# Altium schematic sheet zxuno.SchDoc
size 386 x 246 mm
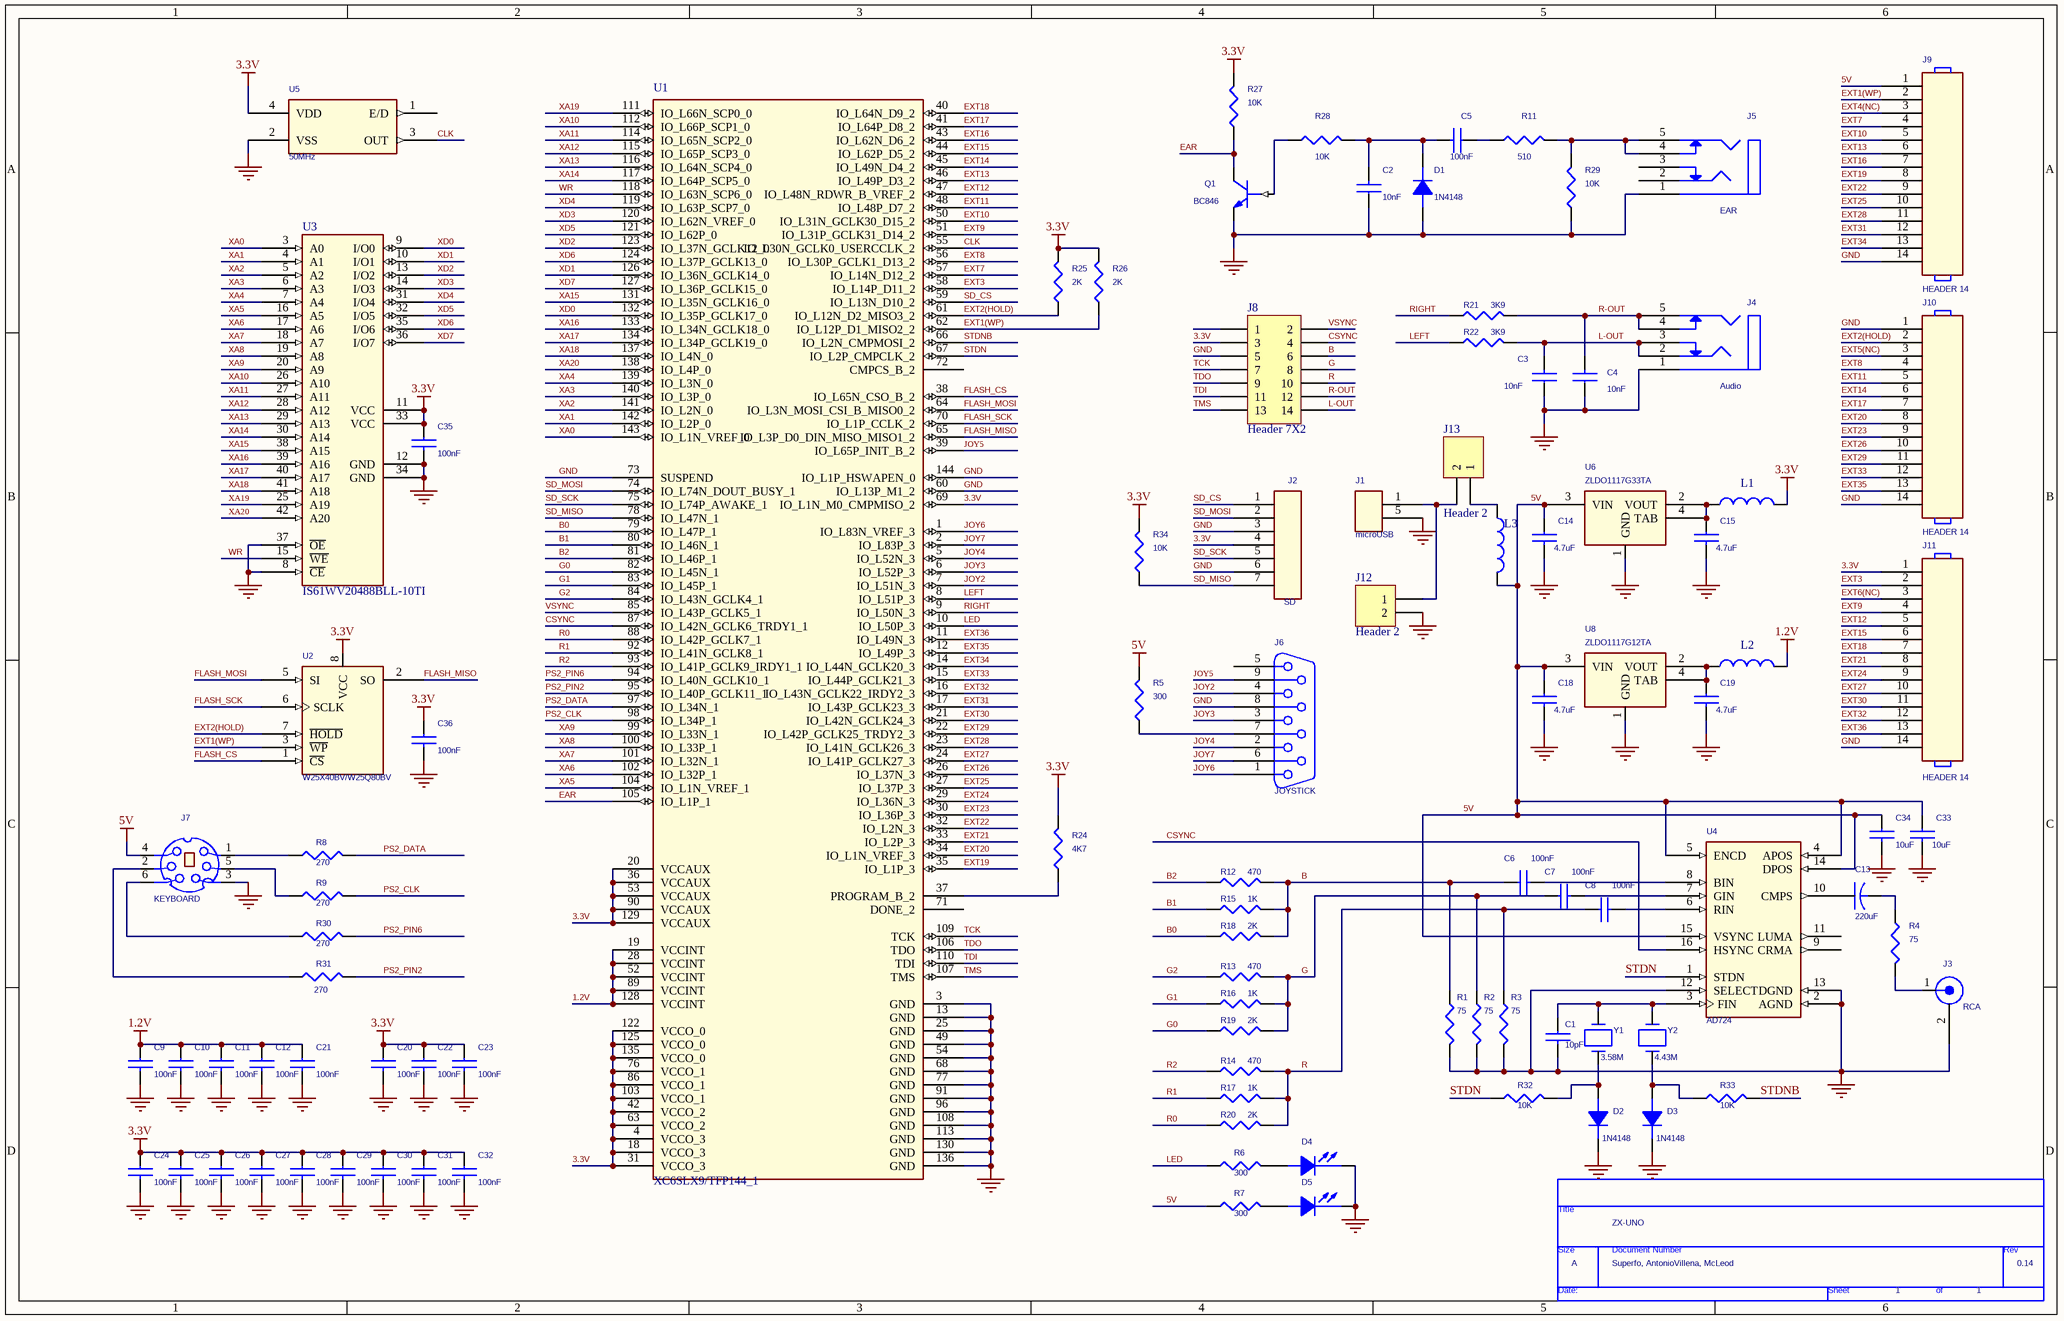
[diagram p0: zxuno.SchDoc]

## Parts
*  Page Count: 1  Page Size: A  Title: ZX-UNO  RevCode: 0.14  Doc: Superfo, AntonioVillena, McLeod  (hidden comment: TitleBlock0)  (graphical)
C1  10pF  [SM/C_0805]
C2  10nF  [SM/C_0805]
C3  10nF  [SM/C_0805]
C4  10nF  [SM/C_0805]
C5  100nF  [SM/C_0603]
C6  100nF  [SM/C_0603]
C7  100nF  [SM/C_0603]
C8  100nF  [SM/C_0603]
C9  100nF  [SM/C_0603]
C10  100nF  [SM/C_0603]
C11  100nF  [SM/C_0603]
C12  100nF  [SM/C_0603]
C13  220uF  [CAP/D6.6MM]
C14  4.7uF  [SM/C_0805]
C15  4.7uF  [SM/C_0805]
C18  4.7uF  [SM/C_0805]
C19  4.7uF  [SM/C_0805]
C20  100nF  [SM/C_0603]
C21  100nF  [SM/C_0603]
C22  100nF  [SM/C_0603]
C23  100nF  [SM/C_0603]
C24  100nF  [SM/C_0603]
C25  100nF  [SM/C_0603]
C26  100nF  [SM/C_0603]
C27  100nF  [SM/C_0603]
C28  100nF  [SM/C_0603]
C29  100nF  [SM/C_0603]
C30  100nF  [SM/C_0603]
C31  100nF  [SM/C_0603]
C32  100nF  [SM/C_0603]
C33  10uF  [SM/C_0805]
C34  10uF  [SM/C_0805]
C35  100nF  [SM/C_0603]
C36  100nF  [SM/C_0603]
D1  1N4148  [SM/DO213AA_21]
D2  1N4148  [SM/DO213AA_21]
D3  1N4148  [SM/DO213AA_21]
D4  LED  [SM/D_0805_21]  (value not drawn)
D5  LED  [SM/D_0805_21]  (value not drawn)
J1  microUSB  [MICRO USB 609-4613-1-ND]
J2  SD  [SD 101-00708-64-ND]
J3  RCA  [RCA JACK RCJ-04X - duplicate]
J4  Audio  [AUDIO JACK PSG01538 - duplicate]
J5  EAR  [AUDIO JACK PSG01538 - duplicate]
J6  JOYSTICK  [DSUB/RP.318/TM/9 - duplicate]
J7  KEYBOARD  [DINC/MIN_TM/6]
J8  Header 7X2  [HDR2X7]
J9  HEADER 14  [BLKCON.100/VH/TM1SQ/W.100/14]
J10  HEADER 14  [BLKCON.100/VH/TM1SQ/W.100/14]
J11  HEADER 14  [BLKCON.100/VH/TM1SQ/W.100/14]
J12  Header 2  [HDR1X2]
J13  Header 2  [HDR1X2]
L1  Inductor  [SM/L_0805]  (value not drawn)
L2  Inductor  [SM/L_0805]  (value not drawn)
L3  Inductor  [SM/L_0805]  (value not drawn)
Q1  BC846  [SM/SOT23_231]
R1  75  [SM/R_0805]
R2  75  [SM/R_0805]
R3  75  [SM/R_0805]
R4  75  [SM/R_0805]
R5  300  [SM/R_0805]
R6  300  [SM/R_0805]
R7  300  [SM/R_0805]
R8  270  [SM/R_0805]
R9  270  [SM/R_0805]
R11  510  [SM/R_0805]
R12  470  [SM/R_0805]
R13  470  [SM/R_0805]
R14  470  [SM/R_0805]
R15  1K  [SM/R_0805]
R16  1K  [SM/R_0805]
R17  1K  [SM/R_0805]
R18  2K  [SM/R_0805]
R19  2K  [SM/R_0805]
R20  2K  [SM/R_0805]
R21  3K9  [SM/R_0805]
R22  3K9  [SM/R_0805]
R24  4K7  [SM/R_0805]
R25  2K  [SM/R_0805]
R26  2K  [SM/R_0805]
R27  10K  [SM/R_0805]
R28  10K  [SM/R_0805]
R29  10K  [SM/R_0805]
R30  270  [SM/R_0805]
R31  270  [SM/R_0805]
R32  10K  [SM/R_0805]
R33  10K  [SM/R_0805]
R34  10K  [SM/R_0805]
U1  XC6SLX9/TFP144_1
U2  W25X40BV/W25Q80BV  [SOJ.050/8/WB.300/L.200]
U3  IS61WV20488BLL-10TI  [SOP80P1176-44M]
U4  AD724  [SOJ.050/16/WB.400/L.400]
U5  50MHz  [SM/OSC]
U6  ZLDO1117G33TA  [SM/SOT223]
U8  ZLDO1117G12TA  [SM/SOT223]
Y1  3.58M  [RAD/.300X.125/LS.200/.031]
Y2  4.43M  [RAD/.300X.125/LS.200/.031]

## Nets
1.2V: C9.1 C10.1 C11.1 C12.1 C21.1 L2.2 U1.19(VCCINT) U1.28(VCCINT) U1.52(VCCINT) U1.89(VCCINT) U1.128(VCCINT)
3.3V: C20.1 C22.1 C23.1 C24.1 C25.1 C26.1 C27.1 C28.1 C29.1 C30.1 C31.1 C32.1 C35.1 C36.1 J2.4 J8.3 J11.1 L1.2 R24.2 R25.2 R26.2 R27.1 R34.2 U1.4(VCCO_3) U1.18(VCCO_3) U1.20(VCCAUX) U1.31(VCCO_3) U1.36(VCCAUX) U1.42(VCCO_2) U1.53(VCCAUX) U1.63(VCCO_2) U1.69(IO_L1N_M0_CMPMISO_2) U1.76(VCCO_1) U1.86(VCCO_1) U1.90(VCCAUX) U1.103(VCCO_1) U1.122(VCCO_0) U1.125(VCCO_0) U1.129(VCCAUX) U1.135(VCCO_0) U2.8(VCC) U3.11(VCC) U3.33(VCC) U5.4(VDD)
5V: C14.1 C18.1 C33.1 C34.1 J7.4 J9.1 L3.2 R5.2 R7.1 U4.4(APOS) U4.5(ENCD) U4.14(DPOS) U4.15(VSYNC) U6.3(VIN) U8.3(VIN)
GND: C1.2 C2.1 C3.1 C4.1 C9.2 C10.2 C11.2 C12.2 C14.2 C15.2 C18.2 C19.2 C20.2 C21.2 C22.2 C23.2 C24.2 C25.2 C26.2 C27.2 C28.2 C29.2 C30.2 C31.2 C32.2 C33.2 C34.2 C35.2 C36.2 D1.1(A) D2.2(K) D3.2(K) D4.2(CATHODE) D5.2(CATHODE) J1.5 J2.3 J2.6 J3.2(SHIELD) J4.1(E) J5.1(E) J6.8 J7.3 J7.M1(GND) J7.M2(GND) J7.M3(GND) J8.5 J9.14 J10.1 J10.14 J11.14 J12.2 Q1.3(EMITTER) R1.2 R2.2 R3.2 R29.2 U1.3(GND) U1.13(GND) U1.25(GND) U1.49(GND) U1.54(GND) U1.60(IO_L13P_M1_2) U1.68(GND) U1.73(SUSPEND) U1.77(GND) U1.91(GND) U1.96(GND) U1.108(GND) U1.113(GND) U1.130(GND) U1.136(GND) U1.144(IO_L1P_HSWAPEN_0) U2.4(GND) U3.8(~{CE}) U3.12(GND) U3.34(GND) U3.37(~{OE}) U4.2(AGND) U4.12(SELECT) U4.13(DGND) U5.2(VSS) U6.1(GND) U8.1(GND)
B: C6.1 J8.6 R1.1 R12.2 R15.2 R18.2
B0: R18.1 U1.79(IO_L47P_1)
B1: R15.1 U1.80(IO_L46N_1)
B2: R12.1 U1.81(IO_L46P_1)
CLK: U1.55(IO_L30N_GCLK0_USERCCLK_2) U5.3(OUT)
CSYNC: J8.4 U1.87(IO_L42N_GCLK6_TRDY1_1) U4.16(HSYNC)
EAR: Q1.1(COLLECTOR) R27.2 U1.105(IO_L1P_1)
EXT1(WP): J9.2 R26.1 U1.62(IO_L12P_D1_MISO2_2) U2.3(~{WP})
EXT2(HOLD): J10.2 R25.1 U1.61(IO_L12N_D2_MISO3_2) U2.7(~{HOLD})
EXT3: J11.2 U1.58(IO_L14P_D11_2)
EXT4(NC): J9.3
EXT5(NC): J10.3
EXT6(NC): J11.3
EXT7: J9.4 U1.57(IO_L14N_D12_2)
EXT8: J10.4 U1.56(IO_L30P_GCLK1_D13_2)
EXT9: J11.4 U1.51(IO_L31P_GCLK31_D14_2)
EXT10: J9.5 U1.50(IO_L31N_GCLK30_D15_2)
EXT11: J10.5 U1.48(IO_L48P_D7_2)
EXT12: J11.5 U1.47(IO_L48N_RDWR_B_VREF_2)
EXT13: J9.6 U1.46(IO_L49P_D3_2)
EXT14: J10.6 U1.45(IO_L49N_D4_2)
EXT15: J11.6 U1.44(IO_L62P_D5_2)
EXT16: J9.7 U1.43(IO_L62N_D6_2)
EXT17: J10.7 U1.41(IO_L64P_D8_2)
EXT18: J11.7 U1.40(IO_L64N_D9_2)
EXT19: J9.8 U1.35(IO_L1P_3)
EXT20: J10.8 U1.34(IO_L1N_VREF_3)
EXT21: J11.8 U1.33(IO_L2P_3)
EXT22: J9.9 U1.32(IO_L2N_3)
EXT23: J10.9 U1.30(IO_L36P_3)
EXT24: J11.9 U1.29(IO_L36N_3)
EXT25: J9.10 U1.27(IO_L37P_3)
EXT26: J10.10 U1.26(IO_L37N_3)
EXT27: J11.10 U1.24(IO_L41P_GCLK27_3)
EXT28: J9.11 U1.23(IO_L41N_GCLK26_3)
EXT29: J10.11 U1.22(IO_L42P_GCLK25_TRDY2_3)
EXT30: J11.11 U1.21(IO_L42N_GCLK24_3)
EXT31: J9.12 U1.17(IO_L43P_GCLK23_3)
EXT32: J11.12 U1.16(IO_L43N_GCLK22_IRDY2_3)
EXT33: J10.12 U1.15(IO_L44P_GCLK21_3)
EXT34: J9.13 U1.14(IO_L44N_GCLK20_3)
EXT35: J10.13 U1.12(IO_L49P_3)
EXT36: J11.13 U1.11(IO_L49N_3)
FLASH_CS: U1.38(IO_L65N_CSO_B_2) U2.1(~{CS})
FLASH_MISO: U1.65(IO_L3P_D0_DIN_MISO_MISO1_2) U2.2(SO)
FLASH_MOSI: U1.64(IO_L3N_MOSI_CSI_B_MISO0_2) U2.5(SI)
FLASH_SCK: U1.70(IO_L1P_CCLK_2) U2.6(SCLK)
G: C7.1 J8.8 R2.1 R13.2 R16.2 R19.2
G0: R19.1 U1.82(IO_L45N_1)
G1: R16.1 U1.83(IO_L45P_1)
G2: R13.1 U1.84(IO_L43N_GCLK4_1)
JOY2: J6.4 U1.7(IO_L51N_3)
JOY3: J6.3 U1.6(IO_L52P_3)
JOY4: J6.2 U1.5(IO_L52N_3)
JOY5: J6.9 U1.39(IO_L65P_INIT_B_2)
JOY6: J6.1 U1.1(IO_L83N_VREF_3)
JOY7: J6.6 U1.2(IO_L83P_3)
L-OUT: C3.2 J4.2(D) J4.3(C) J8.14 R22.2
LED: R6.1 U1.10(IO_L50P_3)
LEFT: R22.1 U1.8(IO_L51P_3)
PS2_CLK: R9.2 U1.98(IO_L34P_1)
PS2_DATA: R8.2 U1.97(IO_L34N_1)
PS2_PIN2: R31.2 U1.95(IO_L40P_GCLK11_1)
PS2_PIN6: R30.2 U1.94(IO_L40N_GCLK10_1)
R: C8.1 J8.10 R3.1 R14.2 R17.2 R20.2
R0: R20.1 U1.88(IO_L42P_GCLK7_1)
R1: R17.1 U1.92(IO_L41N_GCLK8_1)
R2: R14.1 U1.93(IO_L41P_GCLK9_IRDY1_1)
R-OUT: C4.2 J4.4(B) J4.5(A) J8.12 R21.2
RIGHT: R21.1 U1.9(IO_L50N_3)
SD_CS: J2.1 U1.59(IO_L13N_D10_2)
SD_MISO: J2.7 R34.1 U1.78(IO_L47N_1)
SD_MOSI: J2.2 U1.74(IO_L74N_DOUT_BUSY_1)
SD_SCK: J2.5 U1.75(IO_L74P_AWAKE_1)
STDN: R32.1 U1.67(IO_L2P_CMPCLK_2) U4.1(STDN)
STDNB: R33.2 U1.66(IO_L2N_CMPMOSI_2)
TCK: J8.7 U1.109(TCK)
TDI: J8.11 U1.110(TDI)
TDO: J8.9 U1.106(TDO)
TMS: J8.13 U1.107(TMS)
VSYNC: J8.2 U1.85(IO_L43P_GCLK5_1)
WR: U1.118(IO_L63N_SCP6_0) U3.15(~{WE})
XA0: U1.143(IO_L1N_VREF_0) U3.3(A0)
XA1: U1.142(IO_L2P_0) U3.4(A1)
XA2: U1.141(IO_L2N_0) U3.5(A2)
XA3: U1.140(IO_L3P_0) U3.6(A3)
XA4: U1.139(IO_L3N_0) U3.7(A4)
XA5: U1.104(IO_L1N_VREF_1) U3.16(A5)
XA6: U1.102(IO_L32P_1) U3.17(A6)
XA7: U1.101(IO_L32N_1) U3.18(A7)
XA8: U1.100(IO_L33P_1) U3.19(A8)
XA9: U1.99(IO_L33N_1) U3.20(A9)
XA10: U1.112(IO_L66P_SCP1_0) U3.26(A10)
XA11: U1.114(IO_L65N_SCP2_0) U3.27(A11)
XA12: U1.115(IO_L65P_SCP3_0) U3.28(A12)
XA13: U1.116(IO_L64N_SCP4_0) U3.29(A13)
XA14: U1.117(IO_L64P_SCP5_0) U3.30(A14)
XA15: U1.131(IO_L35N_GCLK16_0) U3.38(A15)
XA16: U1.133(IO_L34N_GCLK18_0) U3.39(A16)
XA17: U1.134(IO_L34P_GCLK19_0) U3.40(A17)
XA18: U1.137(IO_L4N_0) U3.41(A18)
XA19: U1.111(IO_L66N_SCP0_0) U3.25(A19)
XA20: U1.138(IO_L4P_0) U3.42(A20)
XD0: U1.132(IO_L35P_GCLK17_0) U3.9(I/O0)
XD1: U1.126(IO_L36N_GCLK14_0) U3.10(I/O1)
XD2: U1.123(IO_L37N_GCLK12_0) U3.13(I/O2)
XD3: U1.120(IO_L62N_VREF_0) U3.14(I/O3)
XD4: U1.119(IO_L63P_SCP7_0) U3.31(I/O4)
XD5: U1.121(IO_L62P_0) U3.32(I/O5)
XD6: U1.124(IO_L37P_GCLK13_0) U3.35(I/O6)
XD7: U1.127(IO_L36P_GCLK15_0) U3.36(I/O7)
NetC1_1: C1.1 U4.3(FIN) Y1.1 Y2.1
NetC2_2: C2.2 C5.2 D1.2(K) R28.1
NetC5_1: C5.1 R11.2
NetC6_2: C6.2 U4.8(BIN)
NetC7_2: C7.2 U4.7(GIN)
NetC8_2: C8.2 U4.6(RIN)
NetC13_1: C13.1 U4.10(CMPS)
NetC13_2: C13.2 R4.1
NetC15_1: C15.1 L1.1 U6.2(VOUT) U6.4(TAB)
NetC19_1: C19.1 L2.1 U8.2(VOUT) U8.4(TAB)
NetD2_1: D2.1(A) R32.2 Y1.2
NetD3_1: D3.1(A) R33.1 Y2.2
NetD4_1: D4.1(ANODE) R6.2
NetD5_1: D5.1(ANODE) R7.2
NetJ1_1: J1.1 J12.1 J13.2
NetJ3_1: J3.1(CENTER) R4.2
NetJ5_4: J5.4(B) J5.5(A) R11.1 R29.1
NetJ6_7: J6.7 R5.1
NetJ7_1: J7.1 R8.1
NetJ7_2: J7.2 R31.1
NetJ7_5: J7.5 R9.1
NetJ7_6: J7.6 R30.1
NetJ13_1: J13.1 L3.1
NetQ1_2: Q1.2(BASE) R28.2
NetR24_1: R24.1 U1.37(PROGRAM_B_2)

Not connected (* = marked no-connect by the designer): J5 2(D) 3(C); J6 5; J8 1; U1 71(DONE_2) 72(CMPCS_B_2); U4 9(CRMA) 11(LUMA); U5 1(E/D)

## Notes on the sheet
- (in symbol TitleBlock0) Title; Size; Document Number; Rev; Date:; Sheet; of

## Library data of the parts
C1 = CAP NP_Dup1: COMPHEIGHT: 0.000; MEMORY: NO; COMPGROUP: 0; COMPROT: 180; COMPLOC: [670.000,100.000]; COMPSIDE: TOP; FPLIST: SM/C_0805_VIA2,SM/C_0805,RAD/.200X.100/LS.100/.031; DECOUPLER: NO; COMPKEY: NO; COMPLOCKED: NO; COMPFIXED: NO
C2 = CAP NP_Dup1: COMPHEIGHT: 0.000; MEMORY: NO; COMPGROUP: 0; COMPLOC: [2509.000,545.000]; COMPSIDE: BOT; DECOUPLER: NO; COMPKEY: NO; COMPLOCKED: NO; COMPFIXED: NO; COMPROT: 0
C3 = CAP NP_Dup1: COMPHEIGHT: 0.000; MEMORY: NO; COMPGROUP: 0; COMPROT: 270; COMPLOC: [2755.000,1705.000]; COMPSIDE: BOT; FPLIST: SM/C_0805_VIA,SM/C_0805_VIA1,SM/C_0805; DECOUPLER: NO; COMPKEY: NO; COMPLOCKED: NO; COMPFIXED: NO
C4 = CAP NP_Dup1: COMPHEIGHT: 0.000; MEMORY: NO; COMPGROUP: 0; COMPROT: 270; COMPLOC: [2560.000,1705.000]; COMPSIDE: BOT; FPLIST: SM/C_0805_VIA1,SM/C_0805; DECOUPLER: NO; COMPKEY: NO; COMPLOCKED: NO; COMPFIXED: NO
C5 = CAP NP_Dup1: COMPHEIGHT: 0.000; MEMORY: NO; COMPGROUP: 0; COMPLOC: [2510.000,465.000]; COMPSIDE: BOT; DECOUPLER: NO; COMPKEY: NO; COMPLOCKED: NO; COMPFIXED: NO; COMPROT: 0
C6 = CAP NP_Dup1: FPLIST: SM/C_0805; COMPSIDE: TOP; COMPLOC: [1180.000,560.000]; COMPROT: 180; COMPGROUP: 0; COMPFIXED: NO; COMPHEIGHT: 0.000; COMPLOCKED: NO; COMPKEY: NO; DECOUPLER: NO; MEMORY: NO
C7 = CAP NP_Dup1: COMPHEIGHT: 0.000; MEMORY: NO; COMPGROUP: 0; COMPROT: 90; COMPLOC: [1175.000,420.000]; COMPSIDE: TOP; FPLIST: SM/C_0805; DECOUPLER: NO; COMPKEY: NO; COMPLOCKED: NO; COMPFIXED: NO
C8 = CAP NP_Dup1: FPLIST: SM/C_0603,SM/C_0805; COMPSIDE: TOP; COMPLOC: [1100.000,405.000]; COMPROT: 90; COMPGROUP: 0; COMPFIXED: NO; COMPHEIGHT: 0.000; COMPLOCKED: NO; COMPKEY: NO; DECOUPLER: NO; MEMORY: NO
C9 = CAP NP: FPLIST: SM/C_0603_VIA,SM/C_0805,SM/C_0603,SM/C_0603_VIA1; COMPSIDE: BOT; COMPLOC: [1820.000,1500.000]; COMPROT: 180; COMPGROUP: 0; COMPFIXED: NO; COMPHEIGHT: 0.000; COMPLOCKED: NO; COMPKEY: NO; DECOUPLER: NO; MEMORY: NO
C10 = CAP NP: FPLIST: SM/C_0805,SM/C_0603; COMPSIDE: BOT; COMPLOC: [1255.000,1345.000]; COMPROT: 90; COMPGROUP: 0; COMPFIXED: NO; COMPHEIGHT: 0.000; COMPLOCKED: NO; COMPKEY: NO; DECOUPLER: NO; MEMORY: NO
C11 = CAP NP: FPLIST: SM/C_0603,SM/C_0805,SM/C_0603_VIA; COMPSIDE: BOT; COMPLOC: [1440.000,795.000]; COMPROT: 180; COMPGROUP: 0; COMPFIXED: NO; COMPHEIGHT: 0.000; COMPLOCKED: NO; COMPKEY: NO; DECOUPLER: NO; MEMORY: NO
C12 = CAP NP: FPLIST: SM/C_0805,SM/C_0603,SM/C_0603_VIA,SM/C_0603_VIA1,SM/C_0603_VIA2; COMPSIDE: BOT; COMPLOC: [1965.000,916.000]; COMPROT: 90; COMPGROUP: 0; COMPFIXED: NO; COMPHEIGHT: 0.000; COMPLOCKED: NO; COMPKEY: NO; DECOUPLER: NO; MEMORY: NO
C13 = CAP: COMPSIDE: TOP; COMPLOC: [2160.000,2000.000]; COMPROT: 270; COMPGROUP: 0; COMPFIXED: NO; COMPHEIGHT: 0.000; COMPLOCKED: NO; COMPKEY: NO; DECOUPLER: NO; MEMORY: NO
C14 = CAP NP: COMPHEIGHT: 0.000; MEMORY: NO; COMPGROUP: 0; COMPLOC: [340.000,620.000]; COMPSIDE: TOP; FPLIST: SM/C_0805_VIA,SM/C_0805_VIA1,SM/C_0603,SM/C_0805; DECOUPLER: NO; COMPKEY: NO; COMPLOCKED: NO; COMPFIXED: NO; COMPROT: 0
C15 = CAP NP: FPLIST: SM/C_0805,SM/C_0603_VIA,SM/C_0603,SM/C_0805_VIA; COMPSIDE: TOP; COMPLOC: [250.000,620.000]; COMPROT: 180; COMPGROUP: 0; COMPFIXED: NO; COMPHEIGHT: 0.000; COMPLOCKED: NO; COMPKEY: NO; DECOUPLER: NO; MEMORY: NO
C18 = CAP NP: COMPHEIGHT: 0.000; MEMORY: NO; COMPGROUP: 0; COMPLOC: [1485.000,1660.000]; COMPSIDE: BOT; FPLIST: SM/C_0805_VIA2,SM/C_0805_VIA,SM/C_0805_VIA1,SM/C_0603,SM/C_0805; DECOUPLER: NO; COMPKEY: NO; COMPLOCKED: NO; COMPFIXED: NO; COMPROT: 0
C19 = CAP NP: FPLIST: SM/C_0805_VIA2,SM/C_0805,SM/C_0603_VIA,SM/C_0603,SM/C_0805_VIA; COMPSIDE: BOT; COMPLOC: [1575.000,1660.000]; COMPROT: 180; COMPGROUP: 0; COMPFIXED: NO; COMPHEIGHT: 0.000; COMPLOCKED: NO; COMPKEY: NO; DECOUPLER: NO; MEMORY: NO
C20 = CAP NP: FPLIST: SM/C_0603_VIA,SM/C_0603,SM/C_0805,SM/C_0603_VIA1; COMPSIDE: BOT; COMPLOC: [1345.000,1500.000]; COMPROT: 0; COMPFIXED: NO; COMPHEIGHT: 0.000; COMPGROUP: 0; COMPLOCKED: NO; COMPKEY: NO; DECOUPLER: NO; MEMORY: NO
C21 = CAP NP: FPLIST: SM/C_0805,SM/C_0603,SM/C_0603_VIA; COMPSIDE: BOT; COMPLOC: [1255.000,910.000]; COMPROT: 90; COMPGROUP: 0; COMPFIXED: NO; COMPHEIGHT: 0.000; COMPLOCKED: NO; COMPKEY: NO; DECOUPLER: NO; MEMORY: NO
C22 = CAP NP: FPLIST: SM/C_0805,SM/C_0603,SM/C_0603_VIA; COMPSIDE: BOT; COMPLOC: [1874.000,795.000]; COMPROT: 180; COMPGROUP: 0; COMPFIXED: NO; COMPHEIGHT: 0.000; COMPLOCKED: NO; COMPKEY: NO; DECOUPLER: NO; MEMORY: NO
C23 = CAP NP: FPLIST: SM/C_0603,SM/C_0805; COMPSIDE: BOT; COMPLOC: [1965.000,1335.000]; COMPROT: 90; COMPGROUP: 0; COMPFIXED: NO; COMPHEIGHT: 0.000; COMPLOCKED: NO; COMPKEY: NO; DECOUPLER: NO; MEMORY: NO
C24 = CAP NP: FPLIST: SM/C_0603_VIA1,SM/C_0603,SM/C_0805,SM/C_0603_VIA; COMPSIDE: BOT; COMPLOC: [1695.000,1500.000]; COMPROT: 180; COMPGROUP: 0; COMPFIXED: NO; COMPHEIGHT: 0.000; COMPLOCKED: NO; COMPKEY: NO; DECOUPLER: NO; MEMORY: NO
C25 = CAP NP: FPLIST: SM/C_0805,SM/C_0603; COMPSIDE: BOT; COMPLOC: [1415.000,1500.000]; COMPROT: 180; COMPGROUP: 0; COMPFIXED: NO; COMPHEIGHT: 0.000; COMPLOCKED: NO; COMPKEY: NO; DECOUPLER: NO; MEMORY: NO
C26 = CAP NP: FPLIST: SM/C_0805,SM/C_0603; COMPSIDE: BOT; COMPLOC: [1375.000,795.000]; COMPROT: 0; COMPFIXED: NO; COMPHEIGHT: 0.000; COMPGROUP: 0; COMPLOCKED: NO; COMPKEY: NO; DECOUPLER: NO; MEMORY: NO
C27 = CAP NP: FPLIST: SM/C_0603,SM/C_0805; COMPSIDE: BOT; COMPLOC: [1255.000,985.000]; COMPROT: 270; COMPGROUP: 0; COMPFIXED: NO; COMPHEIGHT: 0.000; COMPLOCKED: NO; COMPKEY: NO; DECOUPLER: NO; MEMORY: NO
C28 = CAP NP: FPLIST: SM/C_0603,SM/C_0805,SM/C_0603_VIA; COMPSIDE: BOT; COMPLOC: [1695.000,1325.000]; COMPROT: 0; COMPFIXED: NO; COMPHEIGHT: 0.000; COMPGROUP: 0; COMPLOCKED: NO; COMPKEY: NO; DECOUPLER: NO; MEMORY: NO
C29 = CAP NP: FPLIST: SM/C_0603_VIA1,SM/C_0603_VIA,SM/C_0805,SM/C_0603; COMPSIDE: BOT; COMPLOC: [1255.000,1220.000]; COMPROT: 90; COMPGROUP: 0; COMPFIXED: NO; COMPHEIGHT: 0.000; COMPLOCKED: NO; COMPKEY: NO; DECOUPLER: NO; MEMORY: NO
C30 = CAP NP: FPLIST: SM/C_0805,SM/C_0603; COMPSIDE: BOT; COMPLOC: [1805.000,795.000]; COMPROT: 0; COMPFIXED: NO; COMPHEIGHT: 0.000; COMPGROUP: 0; COMPLOCKED: NO; COMPKEY: NO; DECOUPLER: NO; MEMORY: NO
C31 = CAP NP: FPLIST: SM/C_0603,SM/C_0805,SM/C_0603_VIA,SM/C_0603_VIA1,SM/C_0603_VIA2; COMPSIDE: BOT; COMPLOC: [1965.000,1040.000]; COMPROT: 90; COMPGROUP: 0; COMPFIXED: NO; COMPHEIGHT: 0.000; COMPLOCKED: NO; COMPKEY: NO; DECOUPLER: NO; MEMORY: NO
C32 = CAP NP: COMPHEIGHT: 0.000; MEMORY: NO; COMPGROUP: 0; COMPROT: 270; COMPLOC: [1965.000,1404.000]; COMPSIDE: BOT; FPLIST: SM/C_0805,SM/C_0603,SM/C_0603_VIA; DECOUPLER: NO; COMPKEY: NO; COMPLOCKED: NO; COMPFIXED: NO
C33 = CAP NP: FPLIST: SM/C_0805_VIA2,SM/C_0805,SM/C_0603_VIA,SM/C_0603,SM/C_0805_VIA; COMPSIDE: BOT; COMPLOC: [720.000,260.000]; COMPROT: 270; COMPGROUP: 0; COMPFIXED: NO; COMPHEIGHT: 0.000; COMPLOCKED: NO; COMPKEY: NO; DECOUPLER: NO; MEMORY: NO
C34 = CAP NP: COMPHEIGHT: 0.000; MEMORY: NO; COMPGROUP: 0; COMPROT: 270; COMPLOC: [905.000,360.000]; COMPSIDE: BOT; FPLIST: SM/C_0603,SM/C_0805; DECOUPLER: NO; COMPKEY: NO; COMPLOCKED: NO; COMPFIXED: NO
C35 = CAP NP: COMPHEIGHT: 0.000; MEMORY: NO; COMPGROUP: 0; COMPROT: 90; COMPLOC: [2732.000,1527.000]; COMPSIDE: TOP; FPLIST: SM/C_0603_VIA2,SM/C_0603_VIA,SM/C_0805,SM/C_0603; DECOUPLER: NO; COMPKEY: NO; COMPLOCKED: NO; COMPFIXED: NO
C36 = CAP NP: COMPHEIGHT: 0.000; MEMORY: NO; COMPGROUP: 0; COMPLOC: [1025.000,1280.000]; COMPSIDE: BOT; FPLIST: SM/C_0603_VIA,SM/C_0805,SM/C_0603; DECOUPLER: NO; COMPKEY: NO; COMPLOCKED: NO; COMPFIXED: NO; COMPROT: 0
D1-D3 = DIODE: COMPHEIGHT: 0.000; MEMORY: NO; COMPGROUP: 0; COMPROT: 180; COMPLOC: [2505.000,640.000]; COMPSIDE: BOT; DECOUPLER: NO; COMPKEY: NO; COMPLOCKED: NO; COMPFIXED: NO
D4 = LED: COMPHEIGHT: 0.000; MEMORY: NO; COMPGROUP: 0; COMPLOC: [1980.000,300.000]; COMPSIDE: TOP; DECOUPLER: NO; COMPKEY: NO; COMPLOCKED: NO; COMPFIXED: NO; COMPROT: 0
D5 = LED: COMPHEIGHT: 0.000; MEMORY: NO; COMPGROUP: 0; COMPROT: 90; COMPLOC: [435.000,255.000]; COMPSIDE: TOP; DECOUPLER: NO; COMPKEY: NO; COMPLOCKED: NO; COMPFIXED: NO
J1 = CON2_0: COMPHEIGHT: 0.000; MEMORY: NO; COMPGROUP: 0; COMPROT: 270; COMPLOC: [100.000,295.250]; COMPSIDE: TOP; FPLIST: MINI USB; DECOUPLER: NO; COMPKEY: NO; COMPLOCKED: NO; COMPFIXED: NO
J2 = CON7: COMPHEIGHT: 10.000; MEMORY: NO; COMPFIXED: YES; COMPGROUP: 0; COMPROT: 270; COMPLOC: [590.500,1220.367]; COMPSIDE: BOT; DECOUPLER: NO; COMPKEY: NO; COMPLOCKED: NO
J3 = RCA JACK: COMPHEIGHT: 0.000; MEMORY: NO; COMPFIXED: YES; COMPGROUP: 0; COMPLOC: [1791.183,2027.383]; COMPSIDE: TOP; FPLIST: RCA JACK KY-006-1; DECOUPLER: NO; COMPKEY: NO; COMPLOCKED: NO; COMPROT: 0
J4 = PHONEJACK STEREO SW_0: COMPSIDE: TOP; COMPLOC: [2578.517,2086.433]; COMPROT: 0; COMPFIXED: YES; COMPLOCKED: NO; COMPHEIGHT: 0.000; COMPGROUP: 0; COMPKEY: NO; DECOUPLER: NO; MEMORY: NO
J5 = PHONEJACK STEREO SW_0: FPLIST: AUDIO  JACK MJ1-2510-SMT,AUDIO JACK STX-3120; COMPSIDE: TOP; COMPLOC: [2400.000,120.000]; COMPROT: 180; COMPGROUP: 0; COMPFIXED: NO; COMPHEIGHT: 0.000; COMPLOCKED: NO; COMPKEY: NO; DECOUPLER: NO; MEMORY: NO
J6 = CONNECTOR DB9: COMPHEIGHT: 0.000; MEMORY: NO; COMPFIXED: YES; COMPGROUP: 0; COMPROT: 270; COMPLOC: [2950.000,1600.000]; COMPSIDE: TOP; DECOUPLER: NO; COMPKEY: NO; COMPLOCKED: NO
J7 = M-DIN_0: COMPHEIGHT: 512.000; MEMORY: NO; COMPFIXED: YES; COMPGROUP: 0; COMPROT: 270; COMPLOC: [3385.533,373.983]; COMPSIDE: TOP; DECOUPLER: NO; COMPKEY: NO; COMPLOCKED: NO
J8 = Header 7X2: Header, 7-Pin, Dual row; LatestRevisionDate: 17-Jul-2002; LatestRevisionNote: Re-released for DXP Platform.; Publisher: Altium Limited
J9 = HEADER 14: COMPHEIGHT: 0.000; MEMORY: NO; COMPFIXED: YES; COMPGROUP: 0; COMPLOC: [75.000,1925.000]; COMPSIDE: TOP; DECOUPLER: NO; COMPKEY: NO; COMPLOCKED: NO; COMPROT: 0
J10 = HEADER 14: COMPHEIGHT: 0.000; MEMORY: NO; COMPFIXED: YES; COMPGROUP: 0; COMPLOC: [75.000,2025.000]; COMPSIDE: TOP; DECOUPLER: NO; COMPKEY: NO; COMPLOCKED: NO; COMPROT: 0
J11 = HEADER 14: COMPHEIGHT: 0.000; MEMORY: NO; COMPFIXED: YES; COMPGROUP: 0; COMPLOC: [75.000,2125.000]; COMPSIDE: TOP; FPLIST: BLKCON.100/VH/TM2OE/W.200/26,BLKCON.100/VH/TM2OE/W.200/46; DECOUPLER: NO; COMPKEY: NO; COMPLOCKED: NO; COMPROT: 0
J12 J13 = Header 2: Header, 2-Pin; LatestRevisionDate: 17-Jul-2002; LatestRevisionNote: Re-released for DXP Platform.; Publisher: Altium Limited
L1-L3 = Inductor: Code_IEC: 1005; Value: 10mH; Published: 8-Jun-2000; LatestRevisionDate: 29-May-2009; LatestRevisionNote: IPC-7351 Footprint Added.; PackageReference: 0402-A; Publisher: Altium Limited; PackageDescription: Chip Inductor; Code_JEITA: 0402
Q1 = BC547: COMPHEIGHT: 0.000; MEMORY: NO; COMPGROUP: 0; COMPLOC: [2215.000,625.000]; COMPSIDE: BOT; FPLIST: SM/SOT23_123; DECOUPLER: NO; COMPKEY: NO; COMPLOCKED: NO; COMPFIXED: NO; COMPROT: 0
R1 = R: COMPHEIGHT: 0.000; MEMORY: NO; COMPGROUP: 0; COMPROT: 270; COMPLOC: [1635.000,260.000]; COMPSIDE: BOT; DECOUPLER: NO; COMPKEY: NO; COMPLOCKED: NO; COMPFIXED: NO
R2 = R: COMPHEIGHT: 0.000; MEMORY: NO; COMPGROUP: 0; COMPROT: 270; COMPLOC: [1735.000,260.000]; COMPSIDE: BOT; DECOUPLER: NO; COMPKEY: NO; COMPLOCKED: NO; COMPFIXED: NO
R3 = R: COMPHEIGHT: 0.000; MEMORY: NO; COMPGROUP: 0; COMPROT: 270; COMPLOC: [1835.000,260.000]; COMPSIDE: BOT; DECOUPLER: NO; COMPKEY: NO; COMPLOCKED: NO; COMPFIXED: NO; FPLIST: SM/R_0805
R4 = R: COMPHEIGHT: 0.000; MEMORY: NO; COMPGROUP: 0; COMPLOC: [2035.000,1850.000]; COMPSIDE: BOT; DECOUPLER: NO; COMPKEY: NO; COMPLOCKED: NO; COMPFIXED: NO; COMPROT: 0
R5 = R: COMPSIDE: BOT; COMPLOC: [3150.000,1435.000]; COMPROT: 90; COMPGROUP: 0; COMPFIXED: NO; COMPHEIGHT: 0.000; COMPLOCKED: NO; COMPKEY: NO; DECOUPLER: NO; MEMORY: NO
R6 R32 R33 = R: COMPSIDE: TOP; COMPLOC: [1900.000,395.000]; COMPROT: 0; COMPFIXED: NO; COMPHEIGHT: 0.000; FPLIST: SM/R_0805; COMPGROUP: 0; COMPLOCKED: NO; COMPKEY: NO; DECOUPLER: NO; MEMORY: NO
R7 = R: COMPHEIGHT: 0.000; MEMORY: NO; COMPGROUP: 0; COMPROT: 270; COMPLOC: [435.000,420.000]; COMPSIDE: TOP; DECOUPLER: NO; COMPKEY: NO; COMPLOCKED: NO; COMPFIXED: NO
R8 = R: COMPHEIGHT: 0.000; MEMORY: NO; COMPGROUP: 0; COMPROT: 180; COMPLOC: [2810.000,310.000]; COMPSIDE: TOP; DECOUPLER: NO; COMPKEY: NO; COMPLOCKED: NO; COMPFIXED: NO
R9 = R: COMPHEIGHT: 0.000; MEMORY: NO; COMPGROUP: 0; COMPROT: 180; COMPLOC: [2810.000,480.000]; COMPSIDE: TOP; DECOUPLER: NO; COMPKEY: NO; COMPLOCKED: NO; COMPFIXED: NO
R11 = R: COMPHEIGHT: 0.000; MEMORY: NO; COMPGROUP: 0; COMPROT: 270; COMPLOC: [2605.000,420.000]; COMPSIDE: BOT; DECOUPLER: NO; COMPKEY: NO; COMPLOCKED: NO; COMPFIXED: NO
R12 = R: COMPHEIGHT: 0.000; MEMORY: NO; COMPGROUP: 0; COMPROT: 180; COMPLOC: [1347.000,388.000]; COMPSIDE: TOP; DECOUPLER: NO; COMPKEY: NO; COMPLOCKED: NO; COMPFIXED: NO; FPLIST: SM/R_0805
R13 = R: COMPSIDE: TOP; COMPLOC: [1395.000,160.000]; COMPROT: 180; COMPGROUP: 0; COMPFIXED: NO; COMPHEIGHT: 0.000; FPLIST: SM/R_0805; COMPLOCKED: NO; COMPKEY: NO; DECOUPLER: NO; MEMORY: NO
R14 = R: COMPHEIGHT: 0.000; MEMORY: NO; COMPGROUP: 0; COMPROT: 270; COMPLOC: [1735.000,500.000]; COMPSIDE: TOP; DECOUPLER: NO; COMPKEY: NO; COMPLOCKED: NO; COMPFIXED: NO
R15 = R: COMPHEIGHT: 0.000; MEMORY: NO; COMPGROUP: 0; COMPROT: 180; COMPLOC: [1347.000,463.000]; COMPSIDE: TOP; DECOUPLER: NO; COMPKEY: NO; COMPLOCKED: NO; COMPFIXED: NO
R16 = R: COMPSIDE: TOP; COMPLOC: [1395.000,235.000]; COMPROT: 180; COMPGROUP: 0; COMPFIXED: NO; COMPHEIGHT: 0.000; COMPLOCKED: NO; COMPKEY: NO; DECOUPLER: NO; MEMORY: NO
R17 = R: COMPHEIGHT: 0.000; MEMORY: NO; COMPGROUP: 0; COMPROT: 270; COMPLOC: [1660.000,500.000]; COMPSIDE: TOP; DECOUPLER: NO; COMPKEY: NO; COMPLOCKED: NO; COMPFIXED: NO
R18 = R: COMPHEIGHT: 0.000; MEMORY: NO; COMPGROUP: 0; COMPROT: 180; COMPLOC: [1347.000,538.000]; COMPSIDE: TOP; DECOUPLER: NO; COMPKEY: NO; COMPLOCKED: NO; COMPFIXED: NO
R19 = R: COMPSIDE: TOP; COMPLOC: [1395.000,310.000]; COMPROT: 180; COMPGROUP: 0; COMPFIXED: NO; COMPHEIGHT: 0.000; COMPLOCKED: NO; COMPKEY: NO; DECOUPLER: NO; MEMORY: NO
R20 = R: COMPHEIGHT: 0.000; MEMORY: NO; COMPGROUP: 0; COMPROT: 270; COMPLOC: [1585.000,500.000]; COMPSIDE: TOP; DECOUPLER: NO; COMPKEY: NO; COMPLOCKED: NO; COMPFIXED: NO; FPLIST: SM/R_0805
R21 = R: COMPHEIGHT: 0.000; MEMORY: NO; COMPGROUP: 0; COMPROT: 180; COMPLOC: [2395.000,1790.000]; COMPSIDE: BOT; DECOUPLER: NO; COMPKEY: NO; COMPLOCKED: NO; COMPFIXED: NO; FPLIST: SM/R_0805
R22 = R: COMPHEIGHT: 0.000; MEMORY: NO; COMPGROUP: 0; COMPROT: 270; COMPLOC: [2675.000,1705.000]; COMPSIDE: BOT; DECOUPLER: NO; COMPKEY: NO; COMPLOCKED: NO; COMPFIXED: NO; FPLIST: SM/R_0805
R24 = R: COMPHEIGHT: 0.000; MEMORY: NO; COMPGROUP: 0; COMPLOC: [2015.000,1610.000]; COMPSIDE: TOP; FPLIST: SM/R_0805_VIA1,SM/R_0805; DECOUPLER: NO; COMPKEY: NO; COMPLOCKED: NO; COMPFIXED: NO; COMPROT: 0
R25 R26 = R: COMPHEIGHT: 0.000; MEMORY: NO; COMPGROUP: 0; COMPROT: 180; COMPLOC: [1225.000,1420.000]; COMPSIDE: BOT; FPLIST: SM/R_0805,SM/R_0805_VIA; DECOUPLER: NO; COMPKEY: NO; COMPLOCKED: NO; COMPFIXED: NO
R27 = R: COMPHEIGHT: 0.000; MEMORY: NO; COMPGROUP: 0; COMPROT: 180; COMPLOC: [1900.000,625.000]; COMPSIDE: BOT; DECOUPLER: NO; COMPKEY: NO; COMPLOCKED: NO; COMPFIXED: NO; FPLIST: SM/R_0805
R28 = R: COMPHEIGHT: 0.000; MEMORY: NO; COMPGROUP: 0; COMPLOC: [2335.000,465.000]; COMPSIDE: BOT; DECOUPLER: NO; COMPKEY: NO; COMPLOCKED: NO; COMPFIXED: NO; COMPROT: 0
R29 = R: COMPHEIGHT: 0.000; MEMORY: NO; COMPGROUP: 0; COMPROT: 90; COMPLOC: [2700.000,315.000]; COMPSIDE: BOT; DECOUPLER: NO; COMPKEY: NO; COMPLOCKED: NO; COMPFIXED: NO
R30 = R: COMPHEIGHT: 0.000; MEMORY: NO; COMPGROUP: 0; COMPROT: 180; COMPLOC: [2810.000,225.000]; COMPSIDE: TOP; DECOUPLER: NO; COMPKEY: NO; COMPLOCKED: NO; COMPFIXED: NO; FPLIST: SM/R_0805
R31 = R: COMPHEIGHT: 0.000; MEMORY: NO; COMPGROUP: 0; COMPROT: 180; COMPLOC: [2810.000,565.000]; COMPSIDE: TOP; FPLIST: SM/R_0805,SM/R_0805_VIA1; DECOUPLER: NO; COMPKEY: NO; COMPLOCKED: NO; COMPFIXED: NO
R34 = R: COMPHEIGHT: 0.000; MEMORY: NO; COMPGROUP: 0; COMPROT: 90; COMPLOC: [600.000,866.000]; COMPSIDE: TOP; DECOUPLER: NO; COMPKEY: NO; COMPLOCKED: NO; COMPFIXED: NO; FPLIST: SM/R_0805
U2 = AT45DB011/SOIC_3: COMPHEIGHT: 0.000; MEMORY: NO; COMPGROUP: 0; COMPROT: 180; COMPLOC: [950.000,1185.000]; COMPSIDE: BOT; DECOUPLER: NO; COMPKEY: NO; COMPLOCKED: NO; COMPFIXED: NO
U4 = AD724: COMPHEIGHT: 0.000; MEMORY: NO; COMPGROUP: 0; COMPROT: 90; COMPLOC: [1000.000,210.000]; COMPSIDE: TOP; DECOUPLER: NO; COMPKEY: NO; COMPLOCKED: NO; COMPFIXED: NO
U5 = CS-403/TO_0: COMPSIDE: BOT; COMPLOC: [1695.000,1235.000]; COMPROT: 90; COMPGROUP: 0; COMPFIXED: NO; COMPHEIGHT: 0.000; COMPLOCKED: NO; COMPKEY: NO; DECOUPLER: NO; MEMORY: NO
U6 = REGULATOR-1_0: COMPHEIGHT: 0.000; MEMORY: NO; COMPGROUP: 0; COMPLOC: [160.000,710.000]; COMPSIDE: TOP; DECOUPLER: NO; COMPKEY: NO; COMPLOCKED: NO; COMPFIXED: NO; COMPROT: 0
U8 = REGULATOR-1_0: COMPHEIGHT: 0.000; MEMORY: NO; COMPGROUP: 0; COMPLOC: [1665.000,1750.000]; COMPSIDE: BOT; DECOUPLER: NO; COMPKEY: NO; COMPLOCKED: NO; COMPFIXED: NO; COMPROT: 0
Y1 Y2 = CRYSTAL: COMPHEIGHT: 0.000; MEMORY: NO; COMPGROUP: 0; COMPROT: 180; COMPLOC: [1025.000,100.000]; COMPSIDE: TOP; DECOUPLER: NO; COMPKEY: NO; COMPLOCKED: NO; COMPFIXED: NO
* = TitleBlock0: Page Number: 1; Page Create Date: March  8, 1995